# EAGLE design ultrasonic (EAGLE 5.06)
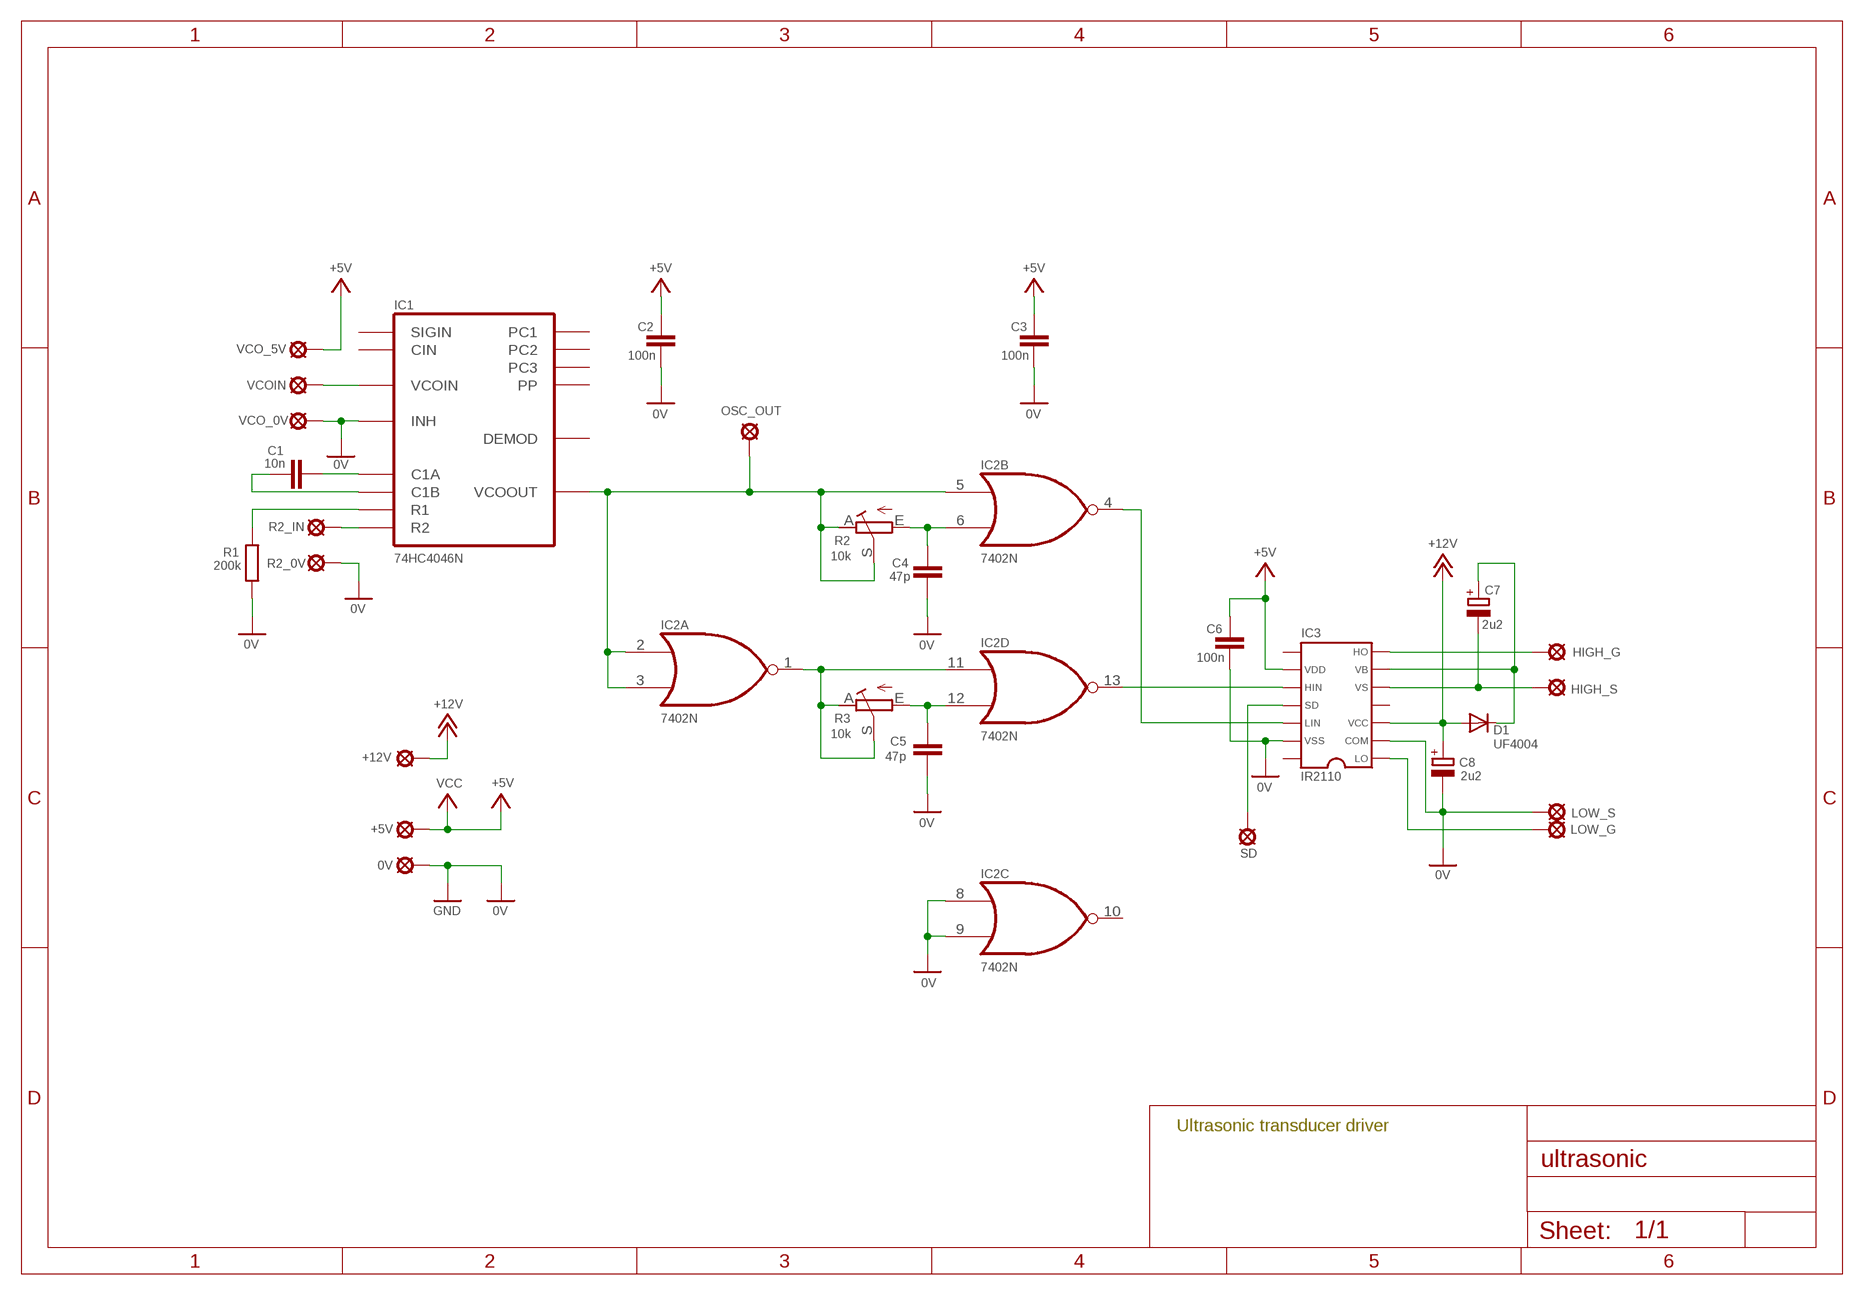
[diagram p0: schematic, sheet 1]

## Parts
0V  LSP10  [LSP10]
+5V  LSP10  [LSP10]
+12V  LSP10  [LSP10]
C1  10n  C-EU050-024X044  [C050-024X044]
C2  100n  C-EU050-024X044  [C050-024X044]
C3  100n  C-EU050-024X044  [C050-024X044]
C4  47p  C-EU050-024X044  [C050-024X044]
C5  47p  C-EU050-024X044  [C050-024X044]
C6  100n  C-EU050-024X044  [C050-024X044]
C7  2u2  CPOL-EUE2.5-5  [E2,5-5]
C8  2u2  CPOL-EUE2.5-5  [E2,5-5]
D1  UF4004  DIODE-D-5  [D-5]
HIGH_G  LSP10  [LSP10]
HIGH_S  LSP10  [LSP10]
IC1  74HC4046N  [DIL16]
IC2  7402N  [DIL14]
IC3  IR2110  [DIL14]
LOW_G  LSP10  [LSP10]
LOW_S  LSP10  [LSP10]
OSC_OUT  LSP10  [LSP10]
R1  200k  R-EU_0207/10  [0207/10]
R2  10k  RTRIM-CA6V  [RTRIMCA6V]
R2_0V  LSP10  [LSP10]
R2_IN  LSP10  [LSP10]
R3  10k  RTRIM-CA6V  [RTRIMCA6V]
SD  LSP10  [LSP10]
VCO_0V  LSP10  [LSP10]
VCO_5V  LSP10  [LSP10]
VCOIN  LSP10  [LSP10]

## Nets
0V: 0V.MP C2.2 C3.2 C4.2 C5.2 C6.2 C8.- IC1.5(INH) IC2.8(C:I0) IC2.9(C:I1) IC3.2 IC3.13 LOW_S.MP R1.1 R2_0V.MP VCO_0V.MP ; supply symbol labelled GND
+5V: +5V.MP C2.1 C3.1 C6.1 IC3.9 VCO_5V.MP ; supply symbol labelled VCC
+12V: +12V.MP C8.+ D1.A IC3.3
N$1: C7.+ D1.C IC3.6
N$2: IC2.13(D:O) IC3.10
N$3: IC2.4(B:O) IC3.12
N$4: IC2.1(A:O) IC2.11(D:I0) R3.A R3.S
N$5: IC3.1 LOW_G.MP
N$6: C7.- HIGH_S.MP IC3.5
N$7: C4.1 IC2.6(B:I1) R2.E
N$8: HIGH_G.MP IC3.7
N$9: IC1.4(VCOOUT) IC2.2(A:I0) IC2.3(A:I1) IC2.5(B:I0) OSC_OUT.MP R2.A R2.S
N$10: C5.1 IC2.12(D:I1) R3.E
N$11: IC1.9(VCOIN) VCOIN.MP
N$12: C1.1 IC1.6(C1A)
N$13: C1.2 IC1.7(C1B)
N$14: IC1.11(R1) R1.2
N$15: IC1.12(R2) R2_IN.MP
N$17: IC3.11 SD.MP
Unconnected: IC1.1(PP) IC1.2(PC1) IC1.3(CIN) IC1.10(DEMOD) IC1.13(PC2) IC1.14(SIGIN) IC1.15(PC3) IC2.10(C:O) IC3.4 IC3.8 IC3.14

## Notes on the sheet
- Ultrasonic transducer driver

## Power pins joined to a net without a drawn wire
0V: IC1.8(GND) IC2.7(P:GND)
+5V: IC1.16(VCC) IC2.14(P:VCC)

## Library data of the parts
0V +5V +12V HIGH_G HIGH_S LOW_G LOW_S OSC_OUT R2_0V R2_IN SD VCO_0V VCO_5V VCOIN = solpad:LSP10: SOLDER PAD drill 1.0 mm, distributor Buerklin, 12H555
C1-C6 = rcl:C-EU: CAPACITOR, European symbol
C7 C8 = rcl:CPOL-EU: POLARIZED CAPACITOR, European symbol
D1 = diode:DIODE-: DIODE
IC1 = lindsay-74-logic:74*4046
IC2 = 74xx-us:74*02: Quad 2-input NOR gate
IC3 = lindsay-mosfet-driver:IR2110
R1 = rcl:R-EU_: RESISTOR, European symbol
R2 R3 = lindsay-rcl:RTRIM

## Board
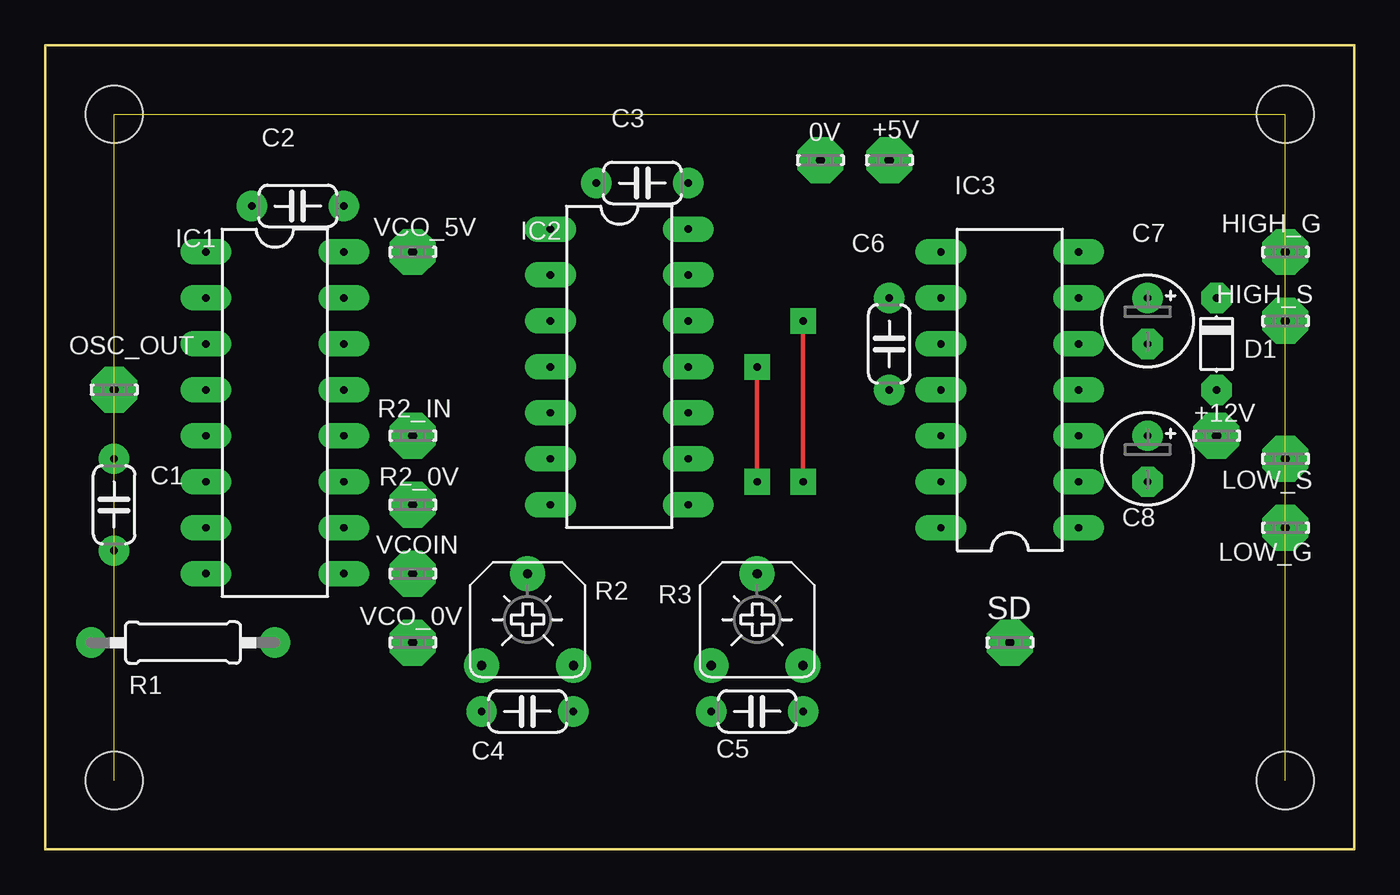
[diagram p1: board, top side]
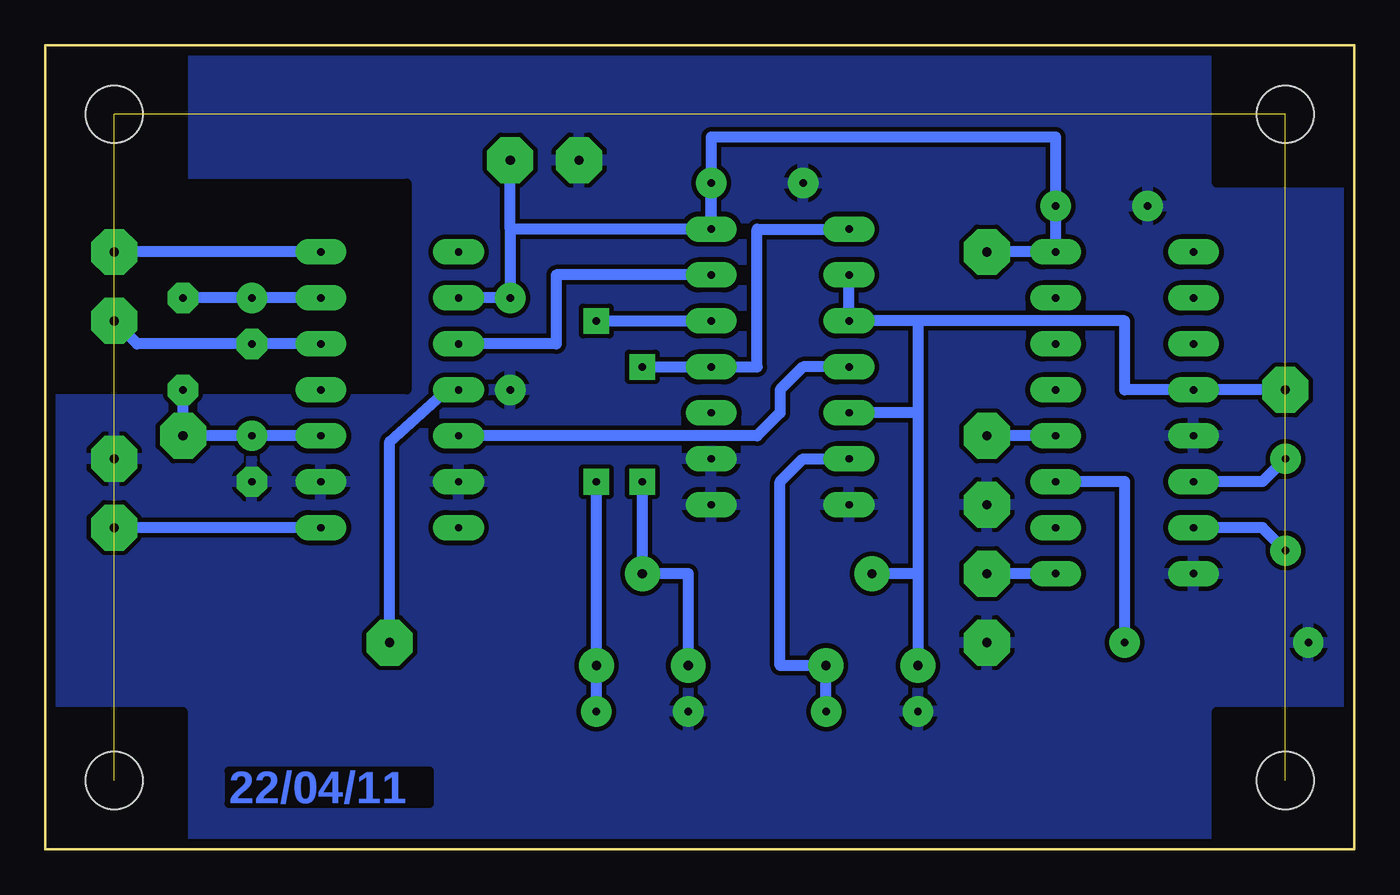
[diagram p2: board, bottom side, seen from below]

Size 72.39 x 44.45 mm. Coordinates in mm from the lower left corner, seen from the top.
Outline: 0,0 72.39,0 72.39,44.45 0,44.45 0,0
Copper layers (1*16): Top 0.035mm / dielectric 1.5mm / Bottom 0.035mm
Design rules "default *": minimum track width 10mil, minimum drill 24mil, track to track 8mil, track to pad 10mil, pad to pad 8mil, via to via 8mil, smd to smd 8mil, copper to edge 20mil, drill to drill 8mil, minimum pad ring 10mil, minimum via ring 8mil, stop-mask expansion 4mil, vias tented up to drill 0mil, thermal gap 10mil
Holes 3.17 mm at 3.81,40.64 3.81,3.81 68.58,3.81 68.58,40.64
bRestrict: area 0,36.8 to 7.6,44.5; area 0,0 to 7.6,7.6; area 64.8,0 to 72.4,7.6; area 64.8,36.8 to 72.4,44.5; area 52.4,25.4 to 72.7,36.8

### Footprints (pad centres in the part's own frame; a part is rotated, then mirrored left to right if it is on the bottom)
LSP10 = drill 0.508 pad 2.54 octagon: MP 0,0
C050-024X044 = drill 0.406 pad 1.676 round: 1 -2.54,0; 2 2.54,0
E2,5-5 = drill 0.406 pad 1.676 round: + -1.27,0 | drill 0.406 pad 1.676 octagon: - 1.27,0
D-5 = drill 0.406 pad 1.676 octagon: A 2.54,0; C -2.54,0
DIL16 = drill 0.406 pad 1.422 long: 1 -8.89,-3.81; 2 -6.35,-3.81; 3 -3.81,-3.81; 4 -1.27,-3.81; 5 1.27,-3.81; 6 3.81,-3.81; 7 6.35,-3.81; 8 8.89,-3.81; 9 8.89,3.81; 10 6.35,3.81; 11 3.81,3.81; 12 1.27,3.81; 13 -1.27,3.81; 14 -3.81,3.81; 15 -6.35,3.81; 16 -8.89,3.81
DIL14 = drill 0.406 pad 1.422 long: 1 -7.62,-3.81; 2 -5.08,-3.81; 3 -2.54,-3.81; 4 0,-3.81; 5 2.54,-3.81; 6 5.08,-3.81; 7 7.62,-3.81; 8 7.62,3.81; 9 5.08,3.81; 10 2.54,3.81; 11 0,3.81; 12 -2.54,3.81; 13 -5.08,3.81; 14 -7.62,3.81
0207/10 = drill 0.406 pad 1.676 round: 1 -5.08,0; 2 5.08,0
RTRIMCA6V = drill 0.508 pad 1.93 round: A -2.54,-2.54; E 2.54,-2.54; S 0,2.54

### Placement (x,y rotation side)
0V  42.86,38.1 0 top
+5V  46.67,38.1 0 top
+12V  64.77,22.86 0 top
C1  3.81,19.05 270 top
C2  13.97,35.56 180 top
C3  33.02,36.83 180 top
C4  26.67,7.62 180 top
C5  39.37,7.62 180 top
C6  46.67,27.94 270 top
C7  60.96,29.21 270 top
C8  60.96,21.59 270 top
D1  64.77,27.94 270 top
HIGH_G  68.58,33.02 0 top
HIGH_S  68.58,29.21 0 top
IC1  12.7,24.13 270 top
IC2  31.75,26.67 270 top
IC3  53.34,25.4 90 top
LOW_G  68.58,17.78 0 top
LOW_S  68.58,21.59 0 top
OSC_OUT  3.81,25.4 0 top
R1  7.62,11.43 0 top
R2  26.67,12.7 0 top
R2_0V  20.32,19.05 0 top
R2_IN  20.32,22.86 0 top
R3  39.37,12.7 0 top
SD  53.34,11.43 0 top
VCO_0V  20.32,11.43 0 top
VCO_5V  20.32,33.02 0 top
VCOIN  20.32,15.24 0 top

### Tracks (layer width: path | path; a pad name or v marks a point on that pad's centre or on a via)
0V
  pour Bottom (isolate 0.254): 0,44.45 72.39,44.45 72.39,0 0,0
+5V
  Bottom 0.61: IC3.9 C6.1 46.67,34.29 | VCO_5V.MP IC1.16 C2.1 16.51,39.37 35.56,39.37 IC2.14 | IC2.14 C3.1 | 46.67,34.29 +5V.MP | IC2.14 46.67,34.29
+12V
  Bottom 0.61: IC3.3 C8.+ +12V.MP D1.A
N$1
  Bottom 0.61: IC3.6 C7.+ D1.C
N$2
  Bottom 0.61: IC2.13 44.13,31.75 44.13,27.94 IC3.10
N$3
  Bottom 0.61: IC2.4 30.48,26.67 31.75,25.4 31.75,24.13 33.02,22.86 IC3.12
N$4  (via drill 0.41 pad 1.42)
  Top 0.254: v39.37,20.32 v39.37,26.67
  Bottom 0.61: R3.A 36.83,15.24 R3.S v39.37,20.32 | IC2.1 33.02,34.29 33.02,26.67 IC2.11 v39.37,26.67
N$5
  Bottom 0.61: IC3.1 LOW_G.MP
N$6
  Bottom 0.61: IC3.5 C7.- 67.31,27.94 HIGH_S.MP
N$7
  Bottom 0.61: C4.1 R2.E 31.75,10.16 31.75,20.32 30.48,21.59 IC2.6
N$8
  Bottom 0.61: IC3.7 HIGH_G.MP
N$9
  Bottom 0.61: 24.13,15.24 R2.A | 24.13,15.24 R2.S | IC2.2 IC2.3 24.13,29.21 | 24.13,29.21 24.13,24.13 | 24.13,24.13 IC2.5 | 24.13,29.21 12.7,29.21 12.7,25.4 IC1.4 OSC_OUT.MP | 24.13,24.13 24.13,15.24
N$10  (via drill 0.41 pad 1.42)
  Top 0.254: v41.91,20.32 v41.91,29.21
  Bottom 0.61: C5.1 R3.E v41.91,20.32 | v41.91,29.21 IC2.12
N$11
  Bottom 0.61: IC1.9 VCOIN.MP
N$12
  Bottom 0.61: C1.1 5.08,20.32 IC1.6
N$13
  Bottom 0.61: C1.2 5.08,17.78 IC1.7
N$14
  Bottom 0.61: R1.2 12.7,20.32 IC1.11
N$15
  Bottom 0.61: IC1.12 R2_IN.MP
N$16  (via drill 0.41 pad 1.42)  (3 unrouted)
  other vias: 3.81,40.64 68.58,40.64 68.58,3.81 3.81,3.81
N$17
  Bottom 0.61: IC3.11 50.16,25.4 53.34,22.54 SD.MP

### Text on the board
Bottom: 22/04/11